# Altium schematic sheet Sheet1.SchDoc
size A4
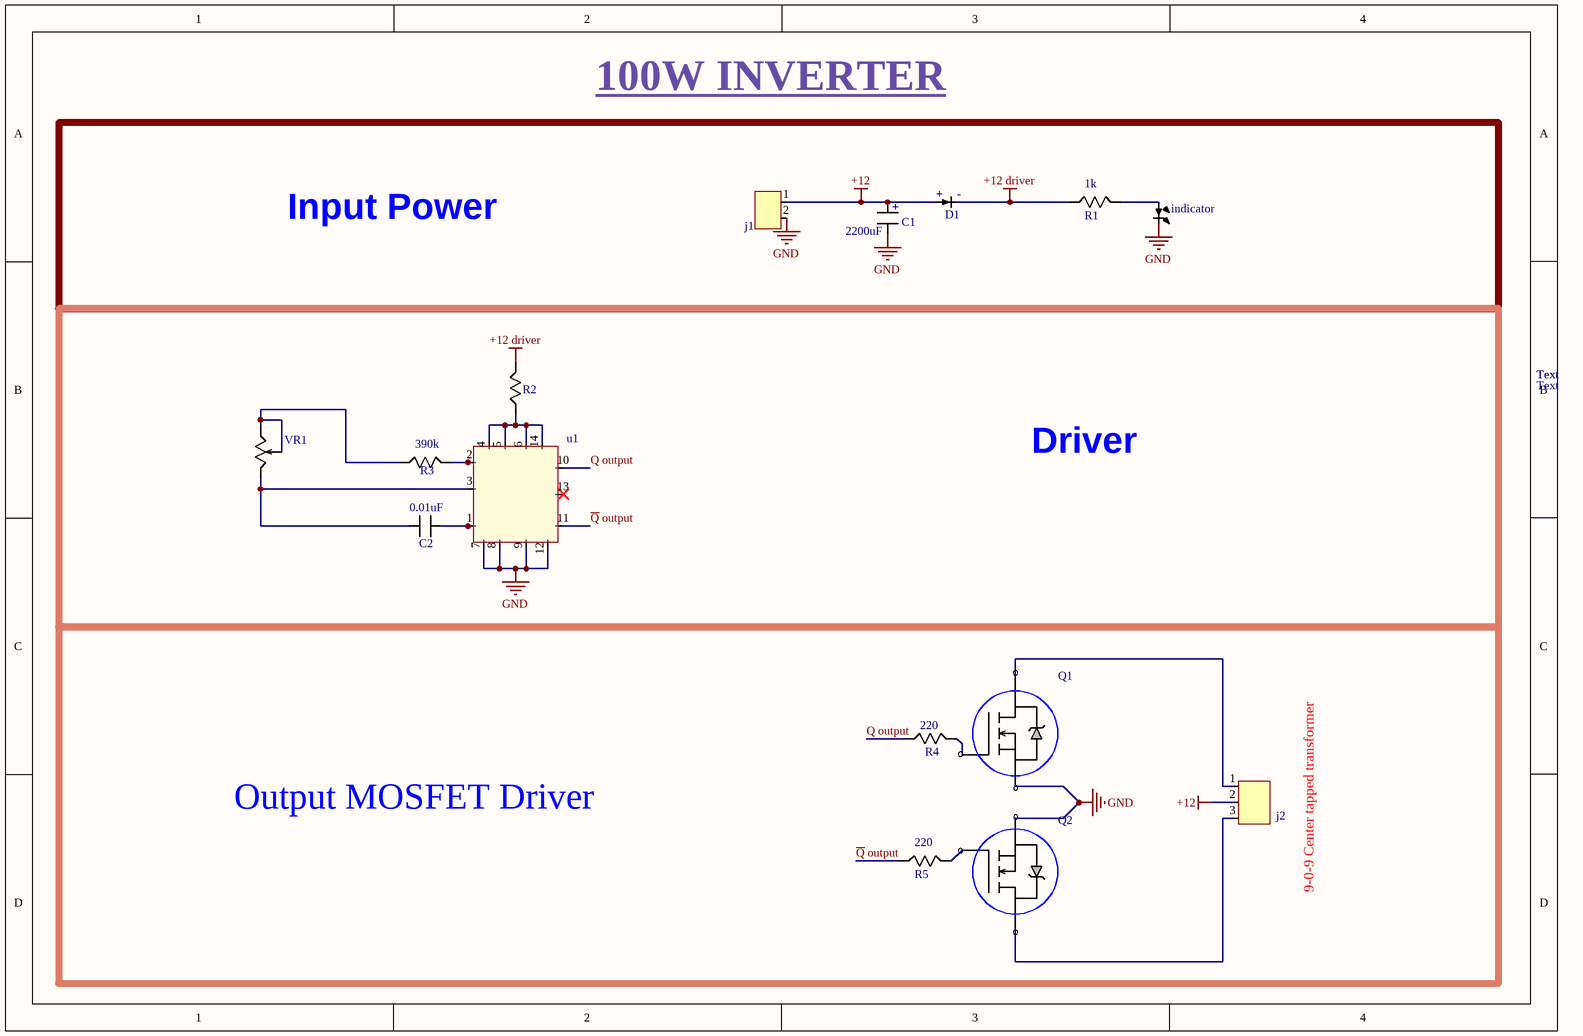
[diagram p0: Sheet1.SchDoc]

## Parts
1  D1  [1N4007_TH_D]
C1  2200uF  [2200uF_35V_Ely_TH]
C2  0.01uF  [0.01uF_cer_th_C - duplicate1]
indicator  LED_3mm_red_TH  [LED_red_TH]  (value not drawn)
j1  2P_5mm_TH  [2pin_5mm_TH]  (value not drawn)
j2  3pin_5mm_TH  [3pin_5mm_TH]  (value not drawn)
Q1  IRF540ZLPBF  [IRF540_TH_MOS]  (value not drawn)
Q2  IRF540ZLPBF  [IRF540_TH_MOS]  (value not drawn)
R1  1k  [1k_0.25_th_R]
R2  R_330_0.25W_TH  [330ohm_th_R]  (value not drawn)
R3  390k  [390ohm_0.25w_th_R]
R4  220  [220ohm_0.25_th_R]
R5  220  [220ohm_0.25_th_R]
u1  CD4047BE IC  [CD4047_TH_IC]  (value not drawn)
VR1  VR_1K_trim_20T  [1k_var_th_R]  (value not drawn)

## Blocks framed on the sheet
Input Power: 1 C1 indicator j1 R1
Driver: C2 R2 R3 u1 VR1
Output MOSFET Driver: j2 Q1 Q2 R4 R5

## Nets
+12: 1.1 C1.1 j1.1 j2.2
+12 driver: 1.2 R1.1 R2.2
GND: C1.2 indicator.2 j1.2 Q1.3 Q2.3 u1.7(VSS) u1.8(+TREGGER) u1.9(EXT_RETREGGER) u1.12(RETREGGER)
Q output: R4.1 u1.10(Q)
~{Q} output: R5.1 u1.11(~{Q})
NetC2_1: C2.1 u1.3(R-C_common) VR1.2
NetC2_2: C2.2 u1.1(C)
Netindicator_1: indicator.1 R1.2
Netj2_1: j2.1 Q1.2
Netj2_3: j2.3 Q2.2
NetQ1_1: Q1.1 R4.2
NetQ2_1: Q2.1 R5.2
NetR2_1: R2.1 u1.4(~{ASTABL}E) u1.5(ASTABLE) u1.6(-TRIGGER) u1.14(VDD)
NetR3_1: R3.1 VR1.1 VR1.3
NetR3_2: R3.2 u1.2(R)

Not connected (* = marked no-connect by the designer): u1 13(OSC_OUT)*

## Notes on the sheet
- 100W INVERTER
- Text
- 9-0-9 Center tapped transformer
- (in symbol C_2200uF_Ely_35V_TH) +
- (in symbol D_1N400_th) +

## Library data of the parts
1 = D_1N400_th: Diode Switching 1KV 1A 2-Pin DO-41 T/R; Manufacturer 1: Diodes; Manufacturer Part Number 1: 1N4007G-T; Max Reverse Current: 5uA; Element Configuration: Single; Max Surge Current: 30A; Reverse Recovery Time: 2us; Polarity: Standard; Capacitance: 8pF; Forward Voltage: 1V; Supplier 1: Digi-Key; RoHS: Yes; Category: Rectifier Diodes; Stock 1: 97269; Pricing 1: 1=0.30000, 10=0.24800, 100=0.13170, 500=0.08662, 1000=0.05890, 2000=0.05313 (USD); Mount: Through Hole; Case/Package: DO-41; Number of Pins: 2; Weight: 0.010582oz; Min Operating Temperature: -65°C; Max Operating Temperature: 175°C; Packaging: Tape and Reel; Package Quantity: 5000; Average Rectified Current: 1A; Max Repetitive Reverse Voltage (Vrrm): 1kV; Peak Non-Repetitive Surge Current: 30A; Voltage Rating (DC): 1kV; Current Rating: 1A; Output Current: 1A; Max Reverse Voltage (DC): 1kV; Recovery Time: 2us; Forward Current: 1A; Reverse Voltage (DC): 1kV; Series: -; Length: 4.7mm; Width: 2.71mm; Height: 2.71mm; Radiation Hardening: No; Lead Free: Lead Free; RoHS Compliant: Yes; ComponentLink1URL: https://datasheet.ciiva.com/36525/1537942-36525995.pdf?src-supplier=Jameco; ComponentLink1Description: https://datasheet.ciiva.com/36525/1537942-36525995.pdf?src-supplier=Jameco; ComponentLink2URL: https://datasheet.ciiva.com/15219/getdatasheetpartid-213960-15219547.pdf?src-supplier=Verical; ComponentLink2Description: https://datasheet.ciiva.com/15219/getdatasheetpartid-213960-15219547.pdf?src-supplier=Verical; ComponentLink3URL: https://datasheet.ciiva.com/25947/ds29002-25947029.pdf?src-supplier=Avnet+Europe; ComponentLink3Description: https://datasheet.ciiva.com/25947/ds29002-25947029.pdf?src-supplier=Avnet+Europe; ComponentLink4URL: https://datasheet.ciiva.com/912/ds29002-912230.pdf?src-supplier=Digi-Key; ComponentLink4Description: https://datasheet.ciiva.com/912/ds29002-912230.pdf?src-supplier=Digi-Key; ComponentLink5URL: https://datasheet.ciiva.com/16395/ds29002-16395514.pdf?src-supplier=Future+Electronics; ComponentLink5Description: https://datasheet.ciiva.com/16395/ds29002-16395514.pdf?src-supplier=Future+Electronics
C1 = C_2200uF_Ely_35V_TH: Aluminum Electrolytic Capacitor, Polarized, Aluminum (wet), 35V, 20% +Tol, 20% -Tol, 2200uF, Through Hole Mount; Manufacturer 1: CDE Illinois Capacitor; Manufacturer Part Number 1: 228CKR035M; Dielectric Material: Aluminium; ESR (Equivalent Series Resistance): 121mR; Ripple Current: 2.09A; Capacitance: 2.2mF; Polarity: Polar; Life (Hours): 2000Hour; Supplier 1: Digi-Key; RoHS: Yes; Category: Aluminum Electrolytic Capacitors; Stock 1: 3987; Pricing 1: 1=1.52000, 10=1.20100, 50=1.04060, 100=0.90040, 500=0.68034, 1000=0.60030, 2500=0.56028, 5000=0.54027 (USD); Mount: Through Hole; Case/Package: Radial; Min Operating Temperature: -40°C; Max Operating Temperature: 85°C; Voltage Rating (DC): 35V; Tolerance: 20%; Voltage Rating: 35V; Package Quantity: 50; Packaging: Bulk; Diameter: 16mm; Height: 31.5mm; Lead Pitch: 0.295inch; Height - Seated (Max): 1.24inch; Lead Free: Lead Free; REACH SVHC: No SVHC; ComponentLink1URL: https://datasheet.ciiva.com/16819/ckr-cks-16819885.pdf?src-supplier=Future+Electronics; ComponentLink1Description: https://datasheet.ciiva.com/16819/ckr-cks-16819885.pdf?src-supplier=Future+Electronics
C2 = C_0.01uF_Cer_50V_TH: Capacitor Ceramic 0.01uF 50V C0G 5% 5mm T/R; Manufacturer 1: TDK; Manufacturer Part Number 1: FA28NP01H103JNU06; Capacitance: 10nF; Lead/Base Style: Kinked; Supplier 1: Digi-Key; RoHS: Yes; Category: Ceramic Capacitors; Stock 1: 2762; Pricing 1: 1=0.48000, 10=0.33700, 50=0.25500, 100=0.22220, 500=0.16456, 1000=0.13988 (USD); Mount: Through Hole; Case/Package: Radial; Min Operating Temperature: -55°C; Max Operating Temperature: 150°C; Packaging: Tape and Reel; Voltage Rating: 50V; Tolerance: 5%; Features: High Temperature; Length: 0.157inch; Width: 0.098inch; Height - Seated (Max): 0.217inch; Lead Pitch: 0.197inch; Ratings: AEC-Q200; RoHS Compliant: Yes; ComponentLink1URL: https://product.tdk.com/info/en/catalog/datasheets/leadmlcc_halogenfree_fa150_en.pdf?src-supplier=Digi-Key; ComponentLink1Description: https://product.tdk.com/info/en/catalog/datasheets/leadmlcc_halogenfree_fa150_en.pdf?src-supplier=Digi-Key
indicator = LED_3mm_red_TH: Manufacturer 1: SunLED; Manufacturer Part Number 1: XLMDK34D; Supplier 1: Digi-Key; RoHS: No; Category: LEDs; Stock 1: 8826; Pricing 1: 1=0.38000, 10=0.30000, 100=0.13470, 500=0.12168, 1000=0.09996, 2000=0.08692, 5000=0.07823, 10000=0.06954, 25000=0.06519 (USD)
j1 = 2P_5mm_TH: TERM BLOCK PLUG 2POS 90DEG 5MM; Manufacturer 1: On-Shore Technology; Manufacturer Part Number 1: OSTTH020100; Number of Positions: 2; Number of Levels: 1; Current: 15A; Voltage: 300V; Wire Gauge (Max): 22AWG; Wire Gauge (Min): 14AWG; Pitch: 0.197inch; Supplier 1: Digi-Key; RoHS: Yes; Category: Terminal Blocks; Stock 1: 527; Pricing 1: 1=0.86000, 10=0.53400, 25=0.45680, 50=0.41080, 100=0.40220, 250=0.34232, 500=0.32518, 1000=0.29096, 5000=0.22820 (USD); Mount: Free Hanging; Number of Pins: 2; Color: Black; Contact Plating: Nickel; Min Operating Temperature: -40°C; Max Operating Temperature: 115°C; Packaging: Bulk; Number of Positions Per Level: 2; Termination: Screw; Series: OSTTH; RoHS Compliant: No; ComponentLink1URL: http://www.on-shore.com/wp-content/uploads/2015/09/ostthxx0160.pdf?src-supplier=Digi-Key; ComponentLink1Description: http://www.on-shore.com/wp-content/uploads/2015/09/ostthxx0160.pdf?src-supplier=Digi-Key
j2 = 3pin_5mm_TH: Connector Terminal Blocks Female 3 Position 5mm Screw Straig; Manufacturer 1: On-Shore Technology; Manufacturer Part Number 1: OSTTH030160; Max Current Rating: 15A; Number of Positions Per Level: 3; Number of Levels: 1; Voltage: 300V; Wire Gauge (Max): 22AWG; Wire Gauge (Min): 14AWG; Pitch: 0.197inch; Supplier 1: Digi-Key; RoHS: Yes; Category: Terminal Blocks; Stock 1: 37899; Pricing 1: 1=1.09000, 10=0.76300, 25=0.71120, 50=0.64540, 100=0.64260, 250=0.54264, 500=0.51408, 1000=0.45696, 5000=0.38080 (USD); Mount: Free Hanging,Cable; Color: Blue; Contact Material: Brass,Steel; Housing Color: Blue; Housing Material: Thermoplastic; Min Operating Temperature: -30°C; Max Operating Temperature: 105°C; Package Quantity: 1; Packaging: Bulk; Number of Rows: 1; Termination: Screw; Current: 15A; Number of Contacts: 3; Orientation: Straight; Number of Positions: 3; Series: OSTTH; Length: 15.7mm; Width: 13.6mm; Height: 11mm; Depth: 13.6mm; Lead Free: Lead Free; Flammability Rating: UL94 V-0; RoHS Compliant: Yes; ComponentLink1URL: https://datasheet.ciiva.com/794/ostthxx0160-794896.pdf?src-supplier=Digi-Key; ComponentLink1Description: https://datasheet.ciiva.com/794/ostthxx0160-794896.pdf?src-supplier=Digi-Key; ComponentLink2URL: https://datasheet.ciiva.com/19475/164806-19475818.pdf?src-supplier=Jameco; ComponentLink2Description: https://datasheet.ciiva.com/19475/164806-19475818.pdf?src-supplier=Jameco
Q1 Q2 = IRF540ZLPBF: Mosfet, Power; N-ch; Vdss 100V; Rds(on) 21MILLIOHMS; Id 36A; TO-262; Pd 92W; Vgs +/-20; Manufacturer 1: Infineon; Gate to Source Voltage (Vgs): 20V; Rds On Max: 26.5mR; Input Capacitance: 1.77nF; Turn-Off Delay Time: 43ns; Turn-On Delay Time: 15ns; Supplier 1: Digi-Key; Manufacturer Part Number 1: IRF540ZLPBF; RoHS: Yes; Category: MOSFETs; Stock 1: 947; Pricing 1: 1=1.59000, 10=1.42500, 100=1.11120, 500=0.91792, 1000=0.80520 (USD); Mount: Through Hole; Case/Package: TO-262; Number of Pins: 3; Min Operating Temperature: -55°C; Max Operating Temperature: 175°C; Continuous Drain Current (ID): 36A; Packaging: Rail/Tube; Power Dissipation: 92W; Drain to Source Voltage (Vdss): 100V; Max Power Dissipation: 92W; Drain to Source Resistance: 26.5mR; Drain to Source Breakdown Voltage: 100V; Max Dual Supply Voltage: 100V; Length: 0.42inch; Width: 0.19inch; Height: 0.38inch; RoHS Compliant: Yes; Lead Free: Contains Lead; Halogen Free: Halogen Free; ComponentLink1URL: https://www.alliedelec.com/m/d/23899d70707f5ac9a5c306f9e15d4494.pdf?src-supplier=Allied+Electronics; ComponentLink1Description: https://www.alliedelec.com/m/d/23899d70707f5ac9a5c306f9e15d4494.pdf?src-supplier=Allied+Electronics; ComponentLink2URL: http://www.infineon.com/dgdl/irf540zpbf.pdf?fileId=5546d462533600a4015355e3af7d19a6&src-supplier=Digi-Key; ComponentLink2Description: http://www.infineon.com/dgdl/irf540zpbf.pdf?fileId=5546d462533600a4015355e3af7d19a6&src-supplier=Digi-Key
R1 = R_1K_0.25W_TH: TE Connectivity CFR16 Series Axial Carbon Film Resistor 1k 5% 0.25W -1200  0ppm/C; Manufacturer Part Number 1: CFR16J1K0; Resistance: 1kR; Temperature Coefficient: 0ppm/°C; Power Rating: 250mW; Voltage Rating: 200V; Number of Resistors: 1; Supplier 1: Digi-Key; Manufacturer 1: TE Connectivity; RoHS: Yes; Category: Through-Hole Resistors; Stock 1: 4940; Pricing 1: 1=0.10000, 10=0.07900, 25=0.05440, 50=0.04240, 100=0.03020, 250=0.02360, 500=0.01876, 1000=0.01331 (USD); Mount: Axial; Case/Package: Axial; Min Operating Temperature: -55°C; Max Operating Temperature: 155°C; Tolerance: 5%; Resistor Type: Thin Film; Termination: Axial; Packaging: Cut Tape; Number of Terminations: 2; Series: CFR16, Neohm; Max Power Dissipation: 250mW; Voltage Rating (DC): 200V; Resistance Tolerance: 5%; Technology: CARBON FILM; Diameter: 1.85mm; Length: 3.5mm; Radiation Hardening: No; RoHS Compliant: Yes; REACH SVHC: No SVHC; ELV: Compliant; ComponentLink1URL: https://datasheet.ciiva.com/11823/0900766b80098b49-11823166.pdf?src-supplier=RSComponents; ComponentLink1Description: https://datasheet.ciiva.com/11823/0900766b80098b49-11823166.pdf?src-supplier=RSComponents; ComponentLink2URL: https://datasheet.ciiva.com/24428/eng-ds-1773195-d-24428424.pdf?src-supplier=Onlinecomponents.com; ComponentLink2Description: https://datasheet.ciiva.com/24428/eng-ds-1773195-d-24428424.pdf?src-supplier=Onlinecomponents.com; ComponentLink3URL: https://datasheet.ciiva.com/22664/1723854-22664943.pdf?src-supplier=Element14; ComponentLink3Description: https://datasheet.ciiva.com/22664/1723854-22664943.pdf?src-supplier=Element14
R2 = R_330_0.25W_TH: TE Connectivity CFR16 Series Axial Carbon Film Resistor 330 5% 0.25W -1200  0ppm/C; Manufacturer Part Number 1: CFR16J330RJIT; Power Rating: 250mW; Resistance: 330R; Temperature Coefficient: 0ppm/°C; Supplier 1: RSComponents; Manufacturer 1: TE Connectivity; RoHS: Yes; Stock 1: 1; Case/Package: Conformal; Min Operating Temperature: -55°C; Max Operating Temperature: 155°C; Tolerance: 5%; Termination: Axial; Diameter: 1.85mm; Length: 3.5mm; ComponentLink1URL: https://datasheet.ciiva.com/11823/0900766b80098b49-11823361.pdf?src-supplier=RSComponents; ComponentLink1Description: https://datasheet.ciiva.com/11823/0900766b80098b49-11823361.pdf?src-supplier=RSComponents
R3 = R_390K_0.25W_TH: RES 390K OHM 1/4W 5% AXIAL; Manufacturer 1: Yageo; Manufacturer Part Number 1: CFR-25JB-52-390K; Resistance: 390kR; Temperature Coefficient: -700ppm/°C; Max Power Dissipation: 250mW; Supplier 1: Digi-Key; RoHS: Yes; Category: Through-Hole Resistors; Stock 1: 11679; Pricing 1: 1=0.10000, 10=0.06700, 25=0.04640, 50=0.03600, 100=0.02580, 250=0.02008, 500=0.01596, 1000=0.01133, 5000=0.00876 (USD); Case/Package: Axial; Min Operating Temperature: -55°C; Max Operating Temperature: 155°C; Package Quantity: 200; Tolerance: 5%; Packaging: Bulk; Resistor Type: Carbon Film; Number of Terminations: 2; Series: CFR; Length: 0.248inch; RoHS Compliant: Yes; Lead Free: Lead Free; ComponentLink1URL: https://datasheet.ciiva.com/2713/yageolr-cfr-2013-2713170.pdf?src-supplier=Digi-Key; ComponentLink1Description: https://datasheet.ciiva.com/2713/yageolr-cfr-2013-2713170.pdf?src-supplier=Digi-Key
R4 R5 = R_220_0.25W_TH: RES 220 OHM 1/4W 5% AXIAL; Manufacturer 1: Stackpole Electronics; Manufacturer Part Number 1: CF14JT220R; Resistance: 220R; Temperature Coefficient: -400ppm/°C; Max Power Dissipation: 250mW; Supplier 1: Digi-Key; RoHS: Yes; Category: Through-Hole Resistors; Stock 1: 142794; Pricing 1: 1=0.10000, 10=0.03600, 25=0.02640, 50=0.02000, 100=0.01480, 250=0.01124, 500=0.00900, 1000=0.00662 (USD); Mount: Through Hole,Axial; Case/Package: Conformal; Contact Plating: Tin,Matte; Min Operating Temperature: -55°C; Max Operating Temperature: 155°C; Package Quantity: 1; Tolerance: 5%; Packaging: Tape and Reel; Resistor Type: Carbon Film; Number of Terminations: 2; Features: Flame Retardant Coating; Series: CF; Power Rating: 250mW; Termination: Axial; Construction: Cylindrical; Diameter: 2.3mm; Length: 6.5mm; Radiation Hardening: No; RoHS Compliant: Yes; Military Standard: Not; Lead Free: Lead Free; ComponentLink1URL: https://www.seielect.com/catalog/SEI-Packaging.pdf?src-supplier=Digi-Key; ComponentLink1Description: https://www.seielect.com/catalog/SEI-Packaging.pdf?src-supplier=Digi-Key; ComponentLink2URL: https://www.seielect.com/catalog/SEI-CF_CFM.pdf?src-supplier=Avnet; ComponentLink2Description: https://www.seielect.com/catalog/SEI-CF_CFM.pdf?src-supplier=Avnet; ComponentLink3URL: https://www.verical.com/server-webapp/html/getDatasheet?partID=375100&src-supplier=Verical; ComponentLink3Description: https://www.verical.com/server-webapp/html/getDatasheet?partID=375100&src-supplier=Verical; ComponentLink4URL: http://components.arrow.com/part/dataview/44988614S316465N1174?src-supplier=Arrow+Electronics; ComponentLink4Description: http://components.arrow.com/part/dataview/44988614S316465N1174?src-supplier=Arrow+Electronics
u1 = CD4047BE IC: MONO/ASTABLE MULTIVIBRATOR, 125NS, DIP-14; Multivibrator Type:Monostable / Astable; Output Current:6.8A; Supply Voltage Min:3V; Supply Voltage Max:18V; Logic Case Style:DIP; No. of Pins:14; Propagation Delay:125ns; Packaging:Each ;RoHS Compliant: Yes; Manufacturer 1: Texas Instruments; High Level Output Current: -4.2mA; Low Level Output Current: 4.2mA; Quiescent Current: 20uA; Independent Circuits: 1; Output Current: 6.8mA; Min Supply Voltage: 3V; Max Supply Voltage: 18V; Turn-On Delay Time: 300ns; Schmitt Trigger Input: No; Operating Supply Voltage: 12V; Max Power Dissipation: 500mW; Input Capacitance: 5pF; Supplier 1: Digi-Key; Manufacturer Part Number 1: CD4047BE; RoHS: Yes; Category: Logic ICs; Stock 1: 117; Pricing 1: 1=0.74000, 10=0.64700, 25=0.60800, 100=0.49610, 250=0.46084, 500=0.39220, 1000=0.32375 (USD); Mount: Through Hole; Case/Package: DIP; Number of Pins: 14; Weight: 0.032734oz; Contact Plating: Gold; Min Operating Temperature: -55°C; Max Operating Temperature: 125°C; Packaging: Rail/Tube; Propagation Delay: 125ns; Logic Function: Multivibrator; Number of Elements: 1; Package Quantity: 25; Number of Bits: 1; Number of Circuits: 1; Max Supply Current: 20uA; Power Dissipation: 500mW; Length: 19.3mm; Width: 6.35mm; Height: 4.57mm; Radiation Hardening: No; Lead Free: Lead Free; REACH SVHC: No SVHC; ComponentLink1URL: https://datasheet.ciiva.com/14134/cd4047b-eng-tds-14134622.pdf?src-supplier=Distrelec; ComponentLink1Description: https://datasheet.ciiva.com/14134/cd4047b-eng-tds-14134622.pdf?src-supplier=Distrelec; ComponentLink2URL: https://datasheet.ciiva.com/27050/894331-27050683.pdf?src-supplier=Jameco; ComponentLink2Description: https://datasheet.ciiva.com/27050/894331-27050683.pdf?src-supplier=Jameco; ComponentLink3URL: https://datasheet.ciiva.com/15095/getdatasheetpartid-72002-15095147.pdf?src-supplier=Verical; ComponentLink3Description: https://datasheet.ciiva.com/15095/getdatasheetpartid-72002-15095147.pdf?src-supplier=Verical; ComponentLink4URL: https://datasheet.ciiva.com/41455/001015487-da-01-en-ic-mono-astbl-multi-cd4047be-pdip-14-tid-41455405.pdf?src-supplier=Conrad; ComponentLink4Description: https://datasheet.ciiva.com/41455/001015487-da-01-en-ic-mono-astbl-multi-cd4047be-pdip-14-tid-41455405.pdf?src-supplier=Conrad; ComponentLink5URL: https://datasheet.ciiva.com/29297/173223-da-01-en-c-mos-ic-cd-4047-be-dip14-tid-29297339.pdf?src-supplier=Conrad; ComponentLink5Description: https://datasheet.ciiva.com/29297/173223-da-01-en-c-mos-ic-cd-4047-be-dip14-tid-29297339.pdf?src-supplier=Conrad; ComponentLink6URL: https://datasheet.ciiva.com/1509/1830980-1509169.pdf?src-supplier=Element14; ComponentLink6Description: https://datasheet.ciiva.com/1509/1830980-1509169.pdf?src-supplier=Element14; ComponentLink7URL: https://datasheet.ciiva.com/1885/cd4047b-1885142.pdf?src-supplier=Digi-Key; ComponentLink7Description: https://datasheet.ciiva.com/1885/cd4047b-1885142.pdf?src-supplier=Digi-Key; ComponentLink8URL: https://datasheet.ciiva.com/3305/cd4047b-3305349.pdf?src-supplier=Avnet; ComponentLink8Description: https://datasheet.ciiva.com/3305/cd4047b-3305349.pdf?src-supplier=Avnet; ComponentLink9URL: https://datasheet.ciiva.com/26242/cd4047b-26242053.pdf?src-supplier=Avnet+Europe; ComponentLink9Description: https://datasheet.ciiva.com/26242/cd4047b-26242053.pdf?src-supplier=Avnet+Europe
VR1 = VR_1K_trim_20T: TRIMMER 1K OHM 1W PC PIN; Manufacturer 1: Bourns; Manufacturer Part Number 1: 3290H-1-102M; Tolerance: 5%; Resistance: 1kR; Temperature Coefficient: 50ppm/°C; Number of Turns: 25; Supplier 1: Digi-Key; RoHS: Yes; Category: Variable Resistors and Potentiometers; Pricing 1: 50=38.65400 (USD); Mount: PCB,Through Hole,Panel; Weight: 0.025oz; Contact Plating: Gold; Min Operating Temperature: -65°C; Max Operating Temperature: 150°C; Packaging: Rail/Tube; Termination: Pin; Series: Trimpot® 3290 - Sealed; Package Quantity: 50; Max Power Dissipation: 1W; Power Rating: 1W; Resistor Type: Wirewound; Taper: Linear; Length: 17.78mm; Height: 0.375inch; Depth: 6.1mm; RoHS Compliant: Yes; Military Standard: Not; ComponentLink1URL: https://datasheet.ciiva.com/2165/3290-2165858.pdf?src-supplier=Digi-Key; ComponentLink1Description: https://datasheet.ciiva.com/2165/3290-2165858.pdf?src-supplier=Digi-Key; ComponentLink2URL: https://datasheet.ciiva.com/16813/3290-16813453.pdf?src-supplier=Avnet+Europe; ComponentLink2Description: https://datasheet.ciiva.com/16813/3290-16813453.pdf?src-supplier=Avnet+Europe